# EAGLE design pecl_pulse_gen (EAGLE 9.2.2)
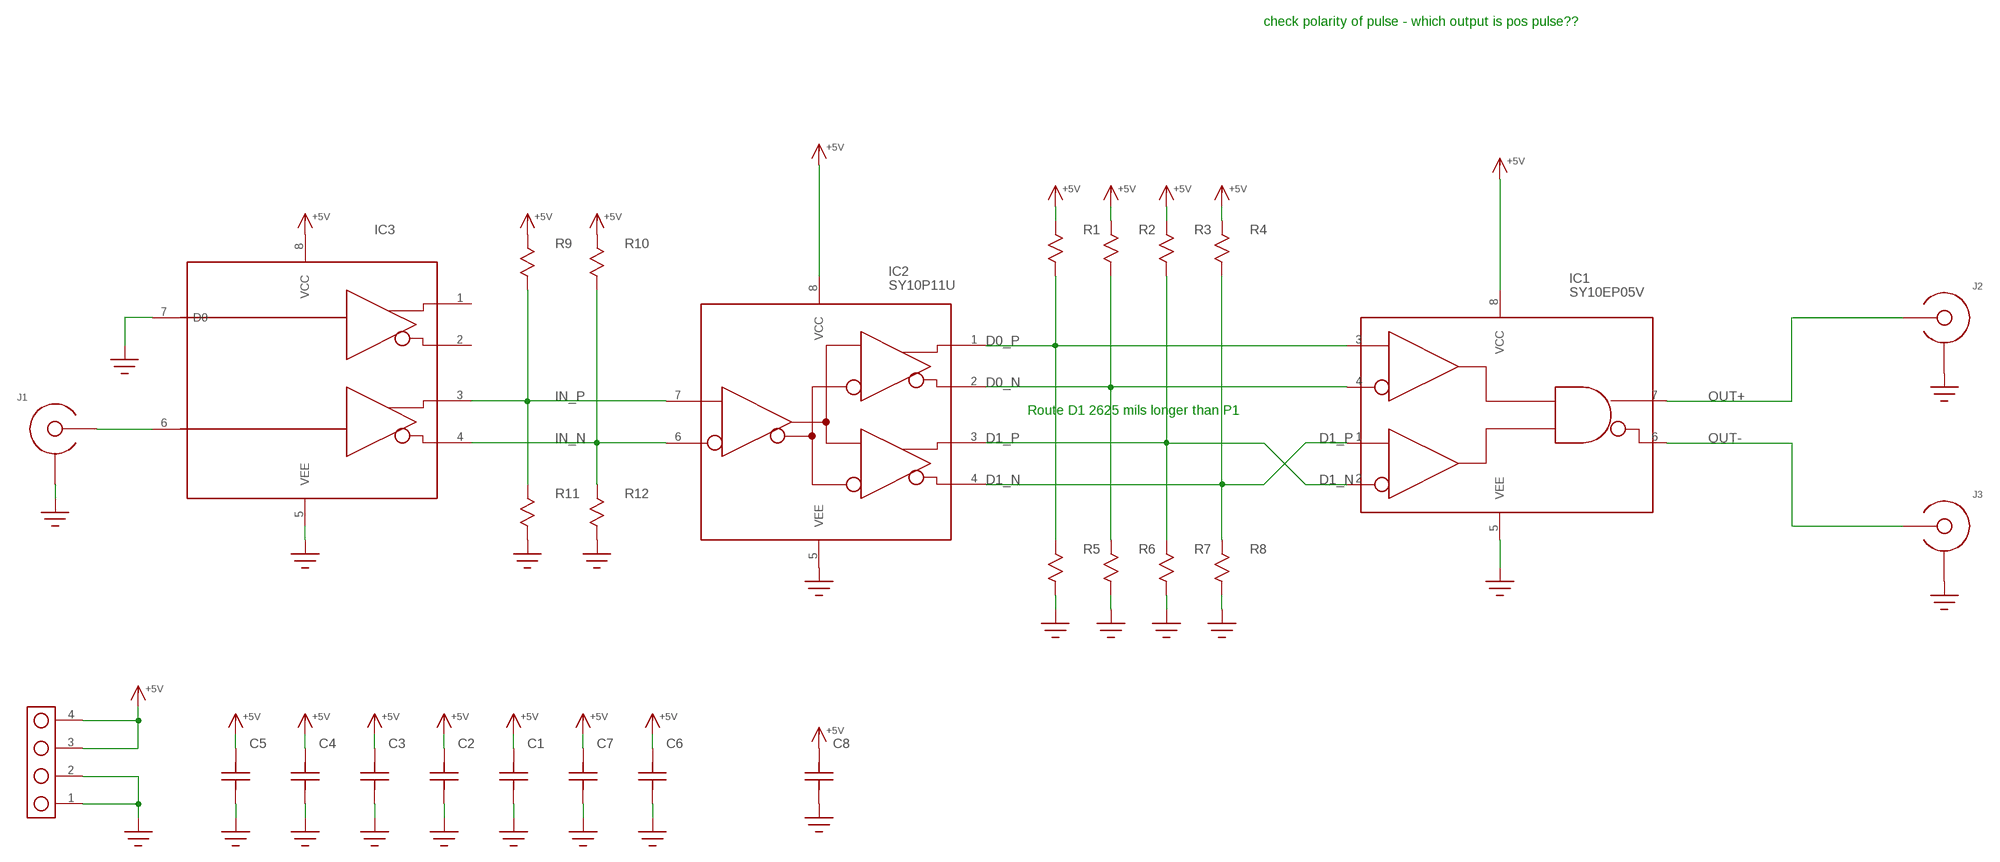
[diagram p0: schematic, sheet 1]

## Parts
C1  C0603  [C0603]
C2  C0603  [C0603]
C3  C0603  [C0603]
C4  C0603  [C0603]
C5  C0603  [C0603]
C6  C0603  [C0603]
C7  C0603  [C0603]
C8  C1206  [1206]
IC1  SY10EP05V  [SOIC8]
IC2  SY10P11U  SY10EP11U  [SOIC8]
IC3  MC100LVELT22  [SOIC8]
J1  EDGE_LAUNCH_JACK  [EDGE_LAUNCH_RF_CON]
J2  EDGE_LAUNCH_JACK  [EDGE_LAUNCH_RF_CON]
J3  EDGE_LAUNCH_JACK  [EDGE_LAUNCH_RF_CON]
J4  HEADER_4PIN  [HEADER_4PIN]
R1  R0402  [0402]
R2  R0402  [0402]
R3  R0402  [0402]
R4  R0402  [0402]
R5  R0402  [0402]
R6  R0402  [0402]
R7  R0402  [0402]
R8  R0402  [0402]
R9  R0402  [0402]
R10  R0402  [0402]
R11  R0402  [0402]
R12  R0402  [0402]

## Nets
+5V: C1.P$2 C2.P$2 C3.P$2 C4.P$2 C5.P$2 C6.P$2 C7.P$2 C8.P$2 IC1.8(VCC) IC2.8(VCC) IC3.8(VCC) J4.3 J4.4 R1.1 R2.1 R3.1 R4.1 R9.1 R10.1
D0_N [100ohm_pair]: IC1.4(!D1!) IC2.2(!Q0!) R2.2 R6.1
D0_P [100ohm_pair]: IC1.3(D1) IC2.1(Q0) R1.2 R5.1
D1_N [100ohm_pair]: IC1.1(D0) IC2.4(!Q1!) R4.2 R8.1
D1_P [100ohm_pair]: IC1.2(!D0!) IC2.3(Q1) R3.2 R7.1
GND: C1.P$1 C2.P$1 C3.P$1 C4.P$1 C5.P$1 C6.P$1 C7.P$1 C8.P$1 IC1.5(VEE) IC2.5(VEE) IC3.5(VEE) IC3.7(D0) J1.GND@1(SHIELD) J1.GND@2(SHIELD) J1.GND@3(SHIELD) J1.GND@4(SHIELD) J1.GND@5(SHIELD) J1.GND@6(SHIELD) J1.GND@7(SHIELD) J1.GND@8(SHIELD) J1.GND@9(SHIELD) J1.GND@10(SHIELD) J1.GND@11(SHIELD) J1.GND@12(SHIELD) J1.SHIELD@1(SHIELD) J1.SHIELD@2(SHIELD) J2.GND@1(SHIELD) J2.GND@2(SHIELD) J2.GND@3(SHIELD) J2.GND@4(SHIELD) J2.GND@5(SHIELD) J2.GND@6(SHIELD) J2.GND@7(SHIELD) J2.GND@8(SHIELD) J2.GND@9(SHIELD) J2.GND@10(SHIELD) J2.GND@11(SHIELD) J2.GND@12(SHIELD) J2.SHIELD@1(SHIELD) J2.SHIELD@2(SHIELD) J3.GND@1(SHIELD) J3.GND@2(SHIELD) J3.GND@3(SHIELD) J3.GND@4(SHIELD) J3.GND@5(SHIELD) J3.GND@6(SHIELD) J3.GND@7(SHIELD) J3.GND@8(SHIELD) J3.GND@9(SHIELD) J3.GND@10(SHIELD) J3.GND@11(SHIELD) J3.GND@12(SHIELD) J3.SHIELD@1(SHIELD) J3.SHIELD@2(SHIELD) J4.1 J4.2 R5.2 R6.2 R7.2 R8.2 R11.2 R12.2
IN_N [100ohm_pair]: IC2.6(!D!) IC3.4(!Q1!) R10.2 R12.1
IN_P [100ohm_pair]: IC2.7(D) IC3.3(Q1) R9.2 R11.1
N$1: IC3.6(D1) J1.CENTER
OUT+: IC1.7(Q) J2.CENTER
OUT-: IC1.6(!Q!) J3.CENTER
Unconnected: IC3.1(Q0) IC3.2(!Q0!)

## Notes on the sheet
- check polarity of pulse - which output is pos pulse??
- Route D1 2625 mils longer than P1

## Library data of the parts
C1-C8 = yapo:C
IC1 = yapo:SY10EP05V
IC2 = yapo:SY10EP11U
IC3 = yapo:MC100LVELT22
J1-J3 = yapo:EDGE_LAUNCH_JACK
J4 = yapo:HEADER_4PIN
R1-R12 = yapo:R

## Net classes
1 100ohm_pair: width 0.345 mm, clearance 0.244 mm

## Board
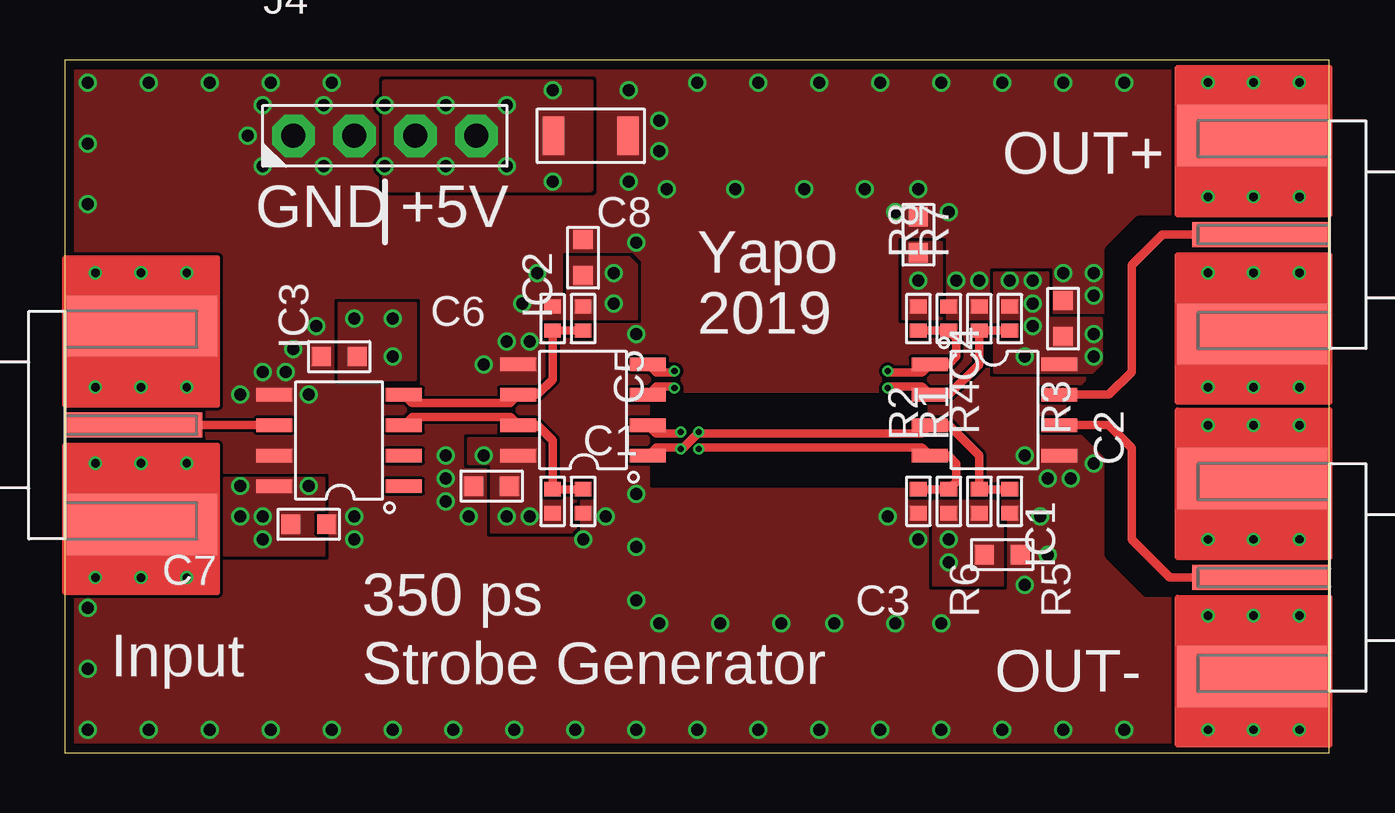
[diagram p1: board, top side]
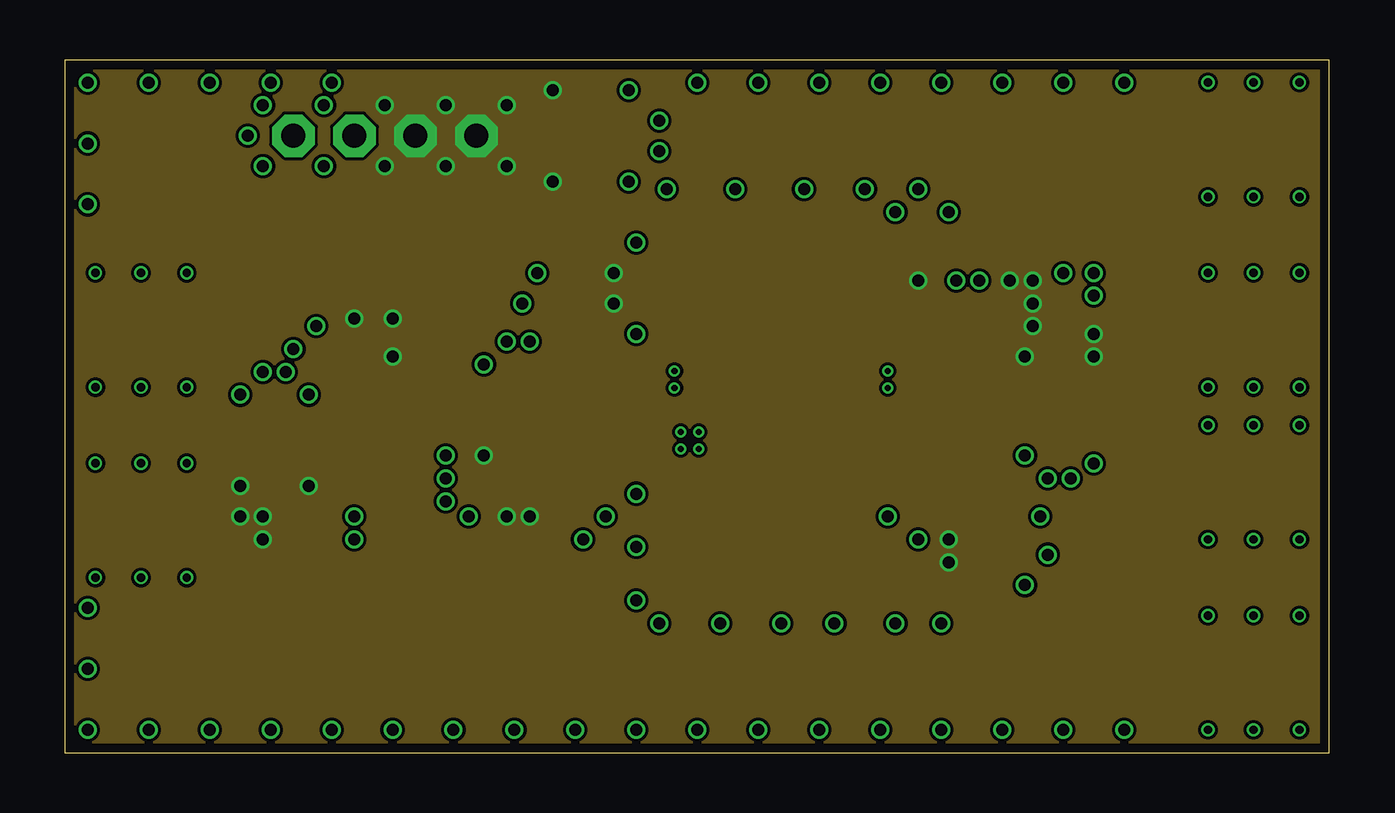
[diagram p2: board, inner layer Route2]
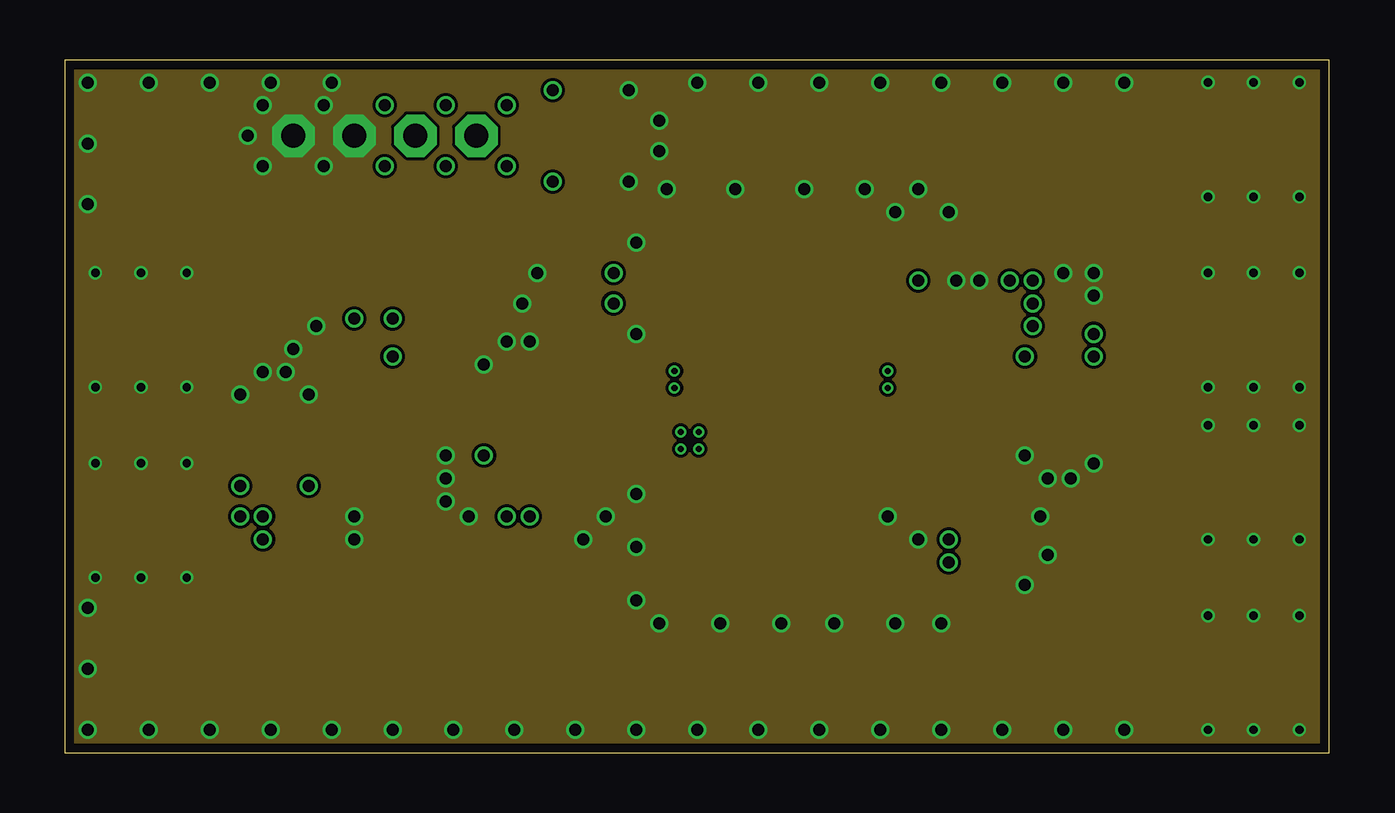
[diagram p3: board, inner layer Route15]
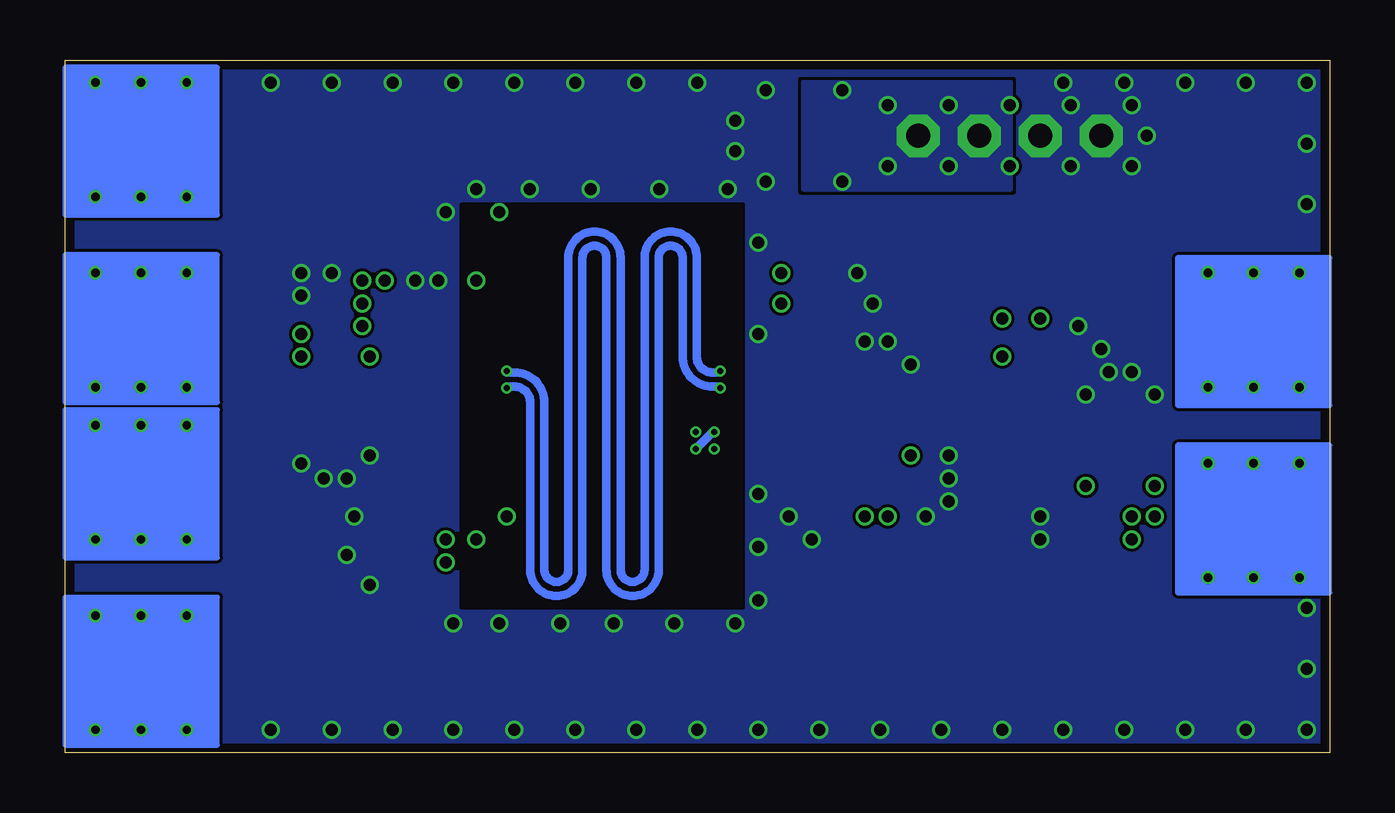
[diagram p4: board, bottom side, seen from below]

Size 52.69 x 28.88 mm. Coordinates in mm from the lower left corner, seen from the top.
Outline: 0,0 52.69,0 52.69,28.88 0,28.88 0,0
Copper layers (1*2*15*16): Top 0.035559375mm / dielectric 0.17018125mm / Route2 0.01778125mm / dielectric 47mil / Route15 0.01778125mm / dielectric 0.17018125mm / Bottom 0.035559375mm
Design rules "oshpark-4layer *": minimum track width 5mil, minimum drill 10mil, track to track 5mil, track to pad 5mil, pad to pad 5mil, via to via 5mil, smd to smd 5mil, copper to edge 15mil, drill to drill 6mil, minimum pad ring 4mil, minimum via ring 4mil, stop-mask expansion 2.5mil, vias tented up to drill 30mil, thermal gap 10mil
tRestrict: area 24.4,11.1 to 35.9,14.9; area 41.9,6.7 to 47,22.2
bRestrict: area 24.4,6 to 36.2,22.9

### Footprints (pad centres in the part's own frame; a part is rotated, then mirrored left to right if it is on the bottom)
C0603 = smd 0.8 x 0.8: P$1 -0.75,0; P$2 0.75,0
1206 = smd 0.9 x 1.6: P$1 -1.55,0; P$2 1.55,0
SOIC8 = smd 0.55 x 1.5: 1 -1.905,-2.7; 2 -0.635,-2.7; 3 0.635,-2.7; 4 1.905,-2.7; 5 1.905,2.7; 6 0.635,2.7; 7 -0.635,2.7; 8 -1.905,2.7
EDGE_LAUNCH_RF_CON = smd 5.715 x 1.041: CENTER -2.875,0 | drill 0.35: GND@1 -5.08,1.587; GND@2 -3.175,1.587; GND@3 -1.27,1.587; GND@4 -5.08,-1.587; GND@5 -3.175,-1.587; GND@6 -1.27,-1.587; GND@7 -5.08,6.35; GND@8 -3.175,6.35; GND@9 -1.27,6.35; GND@10 -5.08,-6.35; GND@11 -3.175,-6.35; GND@12 -1.27,-6.35 | smd 6.35 x 2.54: SHIELD@1 -3.175,-4.128; SHIELD@2 -3.175,4.128
HEADER_4PIN = drill 1 pad 1.778 octagon: 1 -3.81,0; 2 -1.27,0; 3 1.27,0; 4 3.81,0
0402 = smd 0.6 x 0.7: 1 -0.5,0; 2 0.5,0

### Placement (x,y rotation side)
C1  17.78,11.11 0 top
C2  41.59,18.1 270 top
C3  39.05,8.26 180 top
C4  35.56,21.59 270 top
C5  21.59,20.64 270 top
C6  11.43,16.51 0 top
C7  10.16,9.53 180 top
C8  21.91,25.72 180 top
IC1  38.73,14.29 270 top
IC2  21.59,14.29 90 top
IC3  11.43,13.02 90 top
J1  0,13.65 180 top
J2  52.7,21.59 0 top
J3  52.7,7.3 0 top
J4  13.34,25.72 0 top
R1  38.1,10.48 90 top
R2  36.83,10.48 90 top
R3  39.37,18.1 270 top
R4  35.56,18.1 270 top
R5  39.37,10.48 270 top
R6  35.56,10.48 270 top
R7  38.1,18.1 90 top
R8  36.83,18.1 90 top
R9  20.32,10.48 90 top
R10  21.59,18.1 270 top
R11  21.59,10.48 270 top
R12  20.32,18.1 90 top

### Tracks (layer width: path | path; a pad name or v marks a point on that pad's centre or on a via)
+5V  (via drill 0.5)
  other vias: 18.41,9.84 19.37,9.84 36.83,7.94 36.83,8.89 40.01,16.51 40.32,17.78 40.32,18.73 40.32,19.68 39.37,19.68 42.86,17.46 42.86,16.51 22.86,20 22.86,18.73 12.06,18.1 13.65,18.1 13.65,16.51 13.34,24.45 15.88,24.45 18.41,24.45 18.41,26.99 15.88,26.99 13.34,26.99 7.3,11.11 7.3,9.84 8.26,9.84 8.26,8.89 10.16,11.11 35.56,19.68 17.46,12.38 20.32,27.62 20.32,23.81
  pour Top (no thermals): 38.73,15.88 38.73,20 40.96,20 40.96,18.1 43.18,18.1 43.18,15.88
  pour Top (no thermals): 19.67,13.08 16.83,13.08 16.83,12.06 17.78,12.06 17.78,9.21 20.95,9.21 20.95,10.79 19.75,10.79
  pour Top (no thermals): 10.79,8.26 10.79,11.43 6.67,11.43 6.67,8.26
  pour Top (no thermals): 20.95,18.1 20.95,20.64 23.5,20.64 23.81,20.32 23.81,18.1
  pour Top (no thermals): 36.2,10.48 38.73,10.48 39.05,10.16 39.05,6.99 36.2,6.99
  pour Top (no thermals): 34.92,21.27 36.51,21.27 36.51,18.1 34.92,18.1
  pour Top (no thermals): 11.43,18.41 11.43,15.56 14.61,15.56 14.61,18.73 11.43,18.73
  pour Top (no thermals): 13.34,27.94 13.34,23.5 21.91,23.5 21.91,27.94
  pour Bottom (no thermals): 13.34,27.94 13.34,23.5 21.91,23.5 21.91,27.94
  pour Route2 (no thermals): 0,0 52.7,0 52.7,28.89 0,28.89
  pour Top (no thermals): 19.99,13.08 16.83,13.08 16.83,12.06 17.78,12.06 17.78,9.21 21.27,9.21 21.27,10.79 20.07,10.79
D0_N  (via drill 0.25)
  Top 0.345: R6.1 R2.2 37.15,11.29 37.15,12.06 36.83,12.38 IC1.4 35.7,12.72 26.42,12.72 v26.42,12.67 | IC2.2 24.63,13.31 25.65,13.31 v25.65,13.37
  Bottom 0.345: 25.65,13.31 v25.65,13.37 25.72,13.37 v26.42,12.67
D0_P  (via drill 0.25)
  Top 0.345: R5.1 R1.2 38.1,12.38 36.83,13.65 IC1.3 35.7,13.31 26.42,13.31 | IC2.1 24.63,12.72 25.65,12.72 v25.65,12.67 25.72,12.67 26.36,13.31 26.42,13.31 | 26.42,13.31 v26.42,13.37
  Bottom 0.345: 25.65,12.72 v25.65,12.67
D1_N  (via drill 0.25)
  Top 0.345: 24.45,16.21 24.43,16.19 IC2.4 24.63,15.85 25.4,15.85 v25.4,15.91 | R4.2 R8.1 37.15,17.28 37.15,16.51 36.83,16.19 IC1.1 35.7,15.85 34.29,15.85 v34.29,15.91
  Bottom 0.345: v34.29,15.91 34.29,15.85 33.97,15.85 arc90 32.73,14.61 32.73,7.62 arc-90 32.23,7.12 arc-90 31.73,7.62 31.73,20.64 arc90 30.64,21.73 arc90 29.55,20.64 29.55,7.62 arc-90 29.05,7.12 arc-90 28.55,7.62 28.55,20.64 arc90 27.46,21.73 arc90 26.38,20.64 26.38,16.51 arc-90 25.72,15.85 25.4,15.85 v25.4,15.91
D1_P  (via drill 0.25)
  Top 0.345: R3.2 R7.1 38.1,16.19 36.83,14.92 IC1.2 35.7,15.26 34.29,15.26 v34.29,15.21 | IC2.3 24.63,15.26 25.4,15.26 v25.4,15.21
  Bottom 0.345: v34.29,15.21 34.29,15.26 33.97,15.26 arc90 33.31,14.61 33.31,7.62 arc-90 32.23,6.53 arc-90 31.14,7.62 31.14,20.64 arc90 30.64,21.14 arc90 30.14,20.64 30.14,7.62 arc-90 29.05,6.53 arc-90 27.96,7.62 27.96,20.64 arc90 27.46,21.14 arc90 26.96,20.64 26.96,16.51 arc-90 25.72,15.26 25.4,15.26 v25.4,15.21
GND  (via drill 0.5)
  other vias: 12.06,9.84 10.16,14.92 7.3,14.92 8.26,15.88 9.21,15.88 12.06,8.89 15.88,12.38 15.88,11.43 15.88,10.48 17.46,16.19 18.41,17.14 19.37,17.14 19.05,18.73 21.59,8.89 22.54,9.84 34.29,9.84 40.64,9.84 40.96,8.26 40.01,6.99 35.56,8.89 34.61,22.54 35.56,23.5 36.83,22.54 37.15,19.68 38.1,19.68 41.59,20 42.86,20 42.86,19.05 40.01,12.38 40.96,11.43 41.91,11.43 42.86,12.06 10.48,17.78 9.53,16.83 10.79,24.45 10.79,26.99 8.26,26.99 8.26,24.45 7.62,25.72 16.83,9.84 19.68,20 23.5,27.62 24.77,26.35 24.77,25.08 23.5,23.81 23.81,10.79 23.81,8.57 23.81,6.35 23.81,17.46 23.81,21.27 25.08,23.5 27.94,23.5 30.8,23.5 33.34,23.5 24.77,5.4 27.3,5.4 29.84,5.4 32.07,5.4 34.61,5.4 36.51,5.4 0.95,0.95 0.95,3.49 3.49,0.95 6.03,0.95 8.57,0.95 11.11,0.95 13.65,0.95 16.19,0.95 18.73,0.95 21.27,0.95 23.81,0.95 26.35,0.95 28.89,0.95 31.43,0.95 33.97,0.95 36.51,0.95 39.05,0.95 44.13,0.95 41.59,0.95 0.95,27.94 3.49,27.94 6.03,27.94 8.57,27.94 11.11,27.94 26.35,27.94 28.89,27.94 31.43,27.94 33.97,27.94 36.51,27.94 39.05,27.94 41.59,27.94 44.13,27.94 0.95,25.4 0.95,22.86 0.95,6.03
  pour Route15 (no thermals): 0,0 52.7,0 52.7,28.89 0,28.89
  pour Top (rank 2, no thermals): 0,0 53.02,0 53.02,28.57 52.7,28.89 0,28.89
  pour Bottom (rank 2, no thermals): 0,0 53.02,0 53.02,28.89 0,28.89
IN_N
  Top 0.345: R10.2 R12.1 | R12.1 | IC3.4 14.47,14.58 18.55,14.58 IC2.6 19.68,14.92 20.32,15.56 R12.1
IN_P
  Top 0.345: 14.27,13.65 IC3.3 14.47,13.99 18.55,13.99 IC2.7 19.68,13.65 20.32,13.02 R9.2 R11.1
N$1
  Top 0.345: J1.CENTER IC3.6
OUT+
  Top 0.345: IC1.7 43.5,14.92 44.45,15.88 44.45,20.32 45.72,21.59 J2.CENTER
OUT-
  Top 0.345: IC1.6 43.5,13.65 44.45,12.7 44.45,8.89 46.04,7.3 J3.CENTER

### Text on the board
tPlace: OUT+ | GND | +5V | Yapo | 2019 | 350 ps | Input | Strobe Generator | OUT-